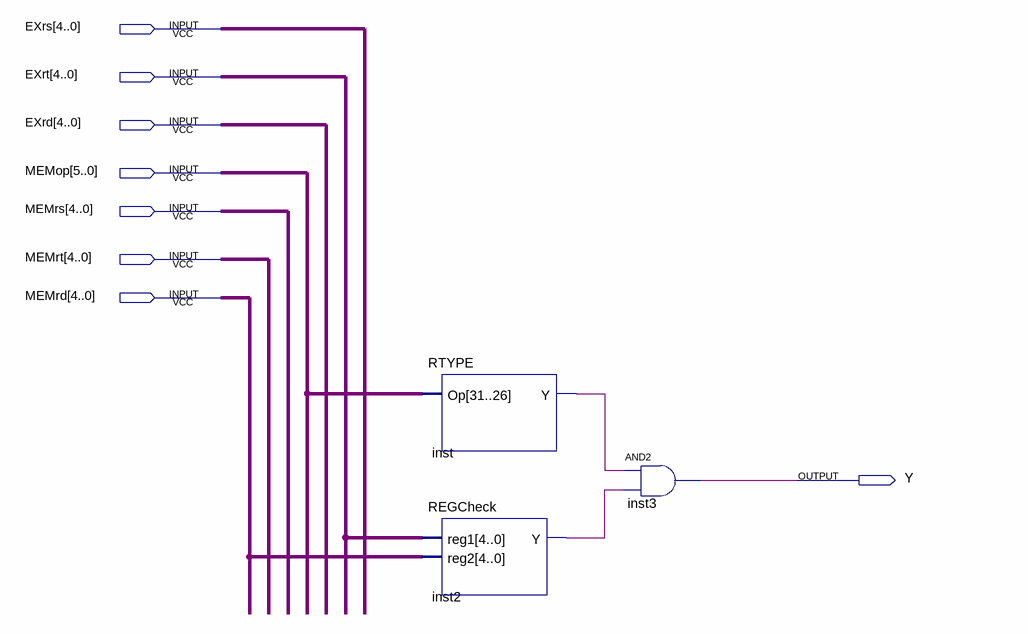
[diagram p0: schematic sheet]
// Quartus schematic ForwardBfromMEMtoEX.bdf as structural Verilog: 3 symbols, 8 pins
module ForwardBfromMEMtoEX (
  input  [4:0] EXrs,
  input  [4:0] EXrt,
  input  [4:0] EXrd,
  input  [5:0] MEMop,
  input  [4:0] MEMrs,
  input  [4:0] MEMrt,
  input  [4:0] MEMrd,
  output Y
);

  wire inst2_y, inst_y;

  RTYPE inst (.Op(MEMop), .Y(inst_y));
  REGCheck inst2 (.reg1(EXrt), .reg2(MEMrd), .Y(inst2_y));
  and inst3 (Y, inst_y, inst2_y);
endmodule
